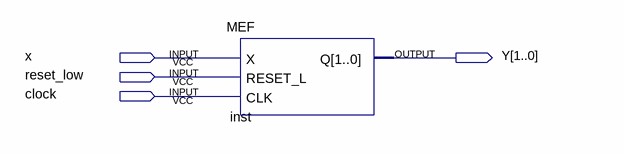
[diagram p0: schematic sheet]
// Quartus schematic bloco_mef.bdf as structural Verilog: 1 symbols, 4 pins
module bloco_mef (
  input  x,
  input  reset_low,
  input  clock,
  output [1:0] Y
);

  MEF inst (.X(x), .RESET_L(reset_low), .CLK(clock), .Q(Y));
endmodule
